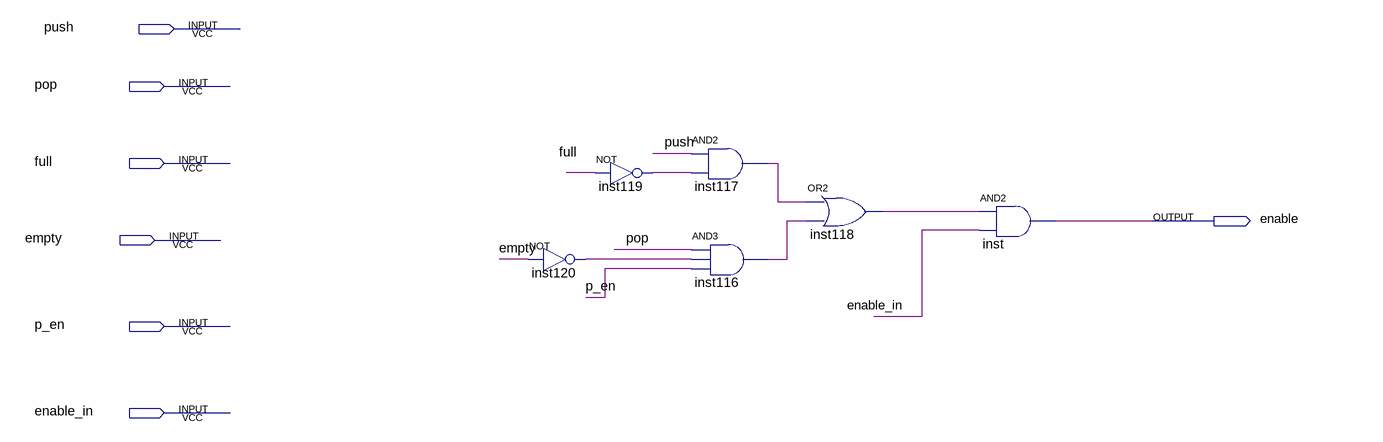
[diagram p0: schematic sheet]
// Quartus schematic g54_enableLogic.bdf as structural Verilog: 6 symbols, 7 pins
module g54_enableLogic (
  input  push,
  input  pop,
  input  full,
  input  empty,
  input  p_en,
  input  enable_in,
  output enable
);

  wire inst116_out, inst117_out, inst118_out, inst119_out, inst120_out;

  not inst120 (inst120_out, empty);
  not inst119 (inst119_out, full);
  and inst117 (inst117_out, push, inst119_out);
  and inst116 (inst116_out, pop, inst120_out, p_en);
  or inst118 (inst118_out, inst117_out, inst116_out);
  and inst (enable, inst118_out, enable_in);
endmodule
